# EAGLE schematic TankWaterLevelSensorV2.3 (EAGLE 9.0.1)
Tank Water Level Sensor Circuit
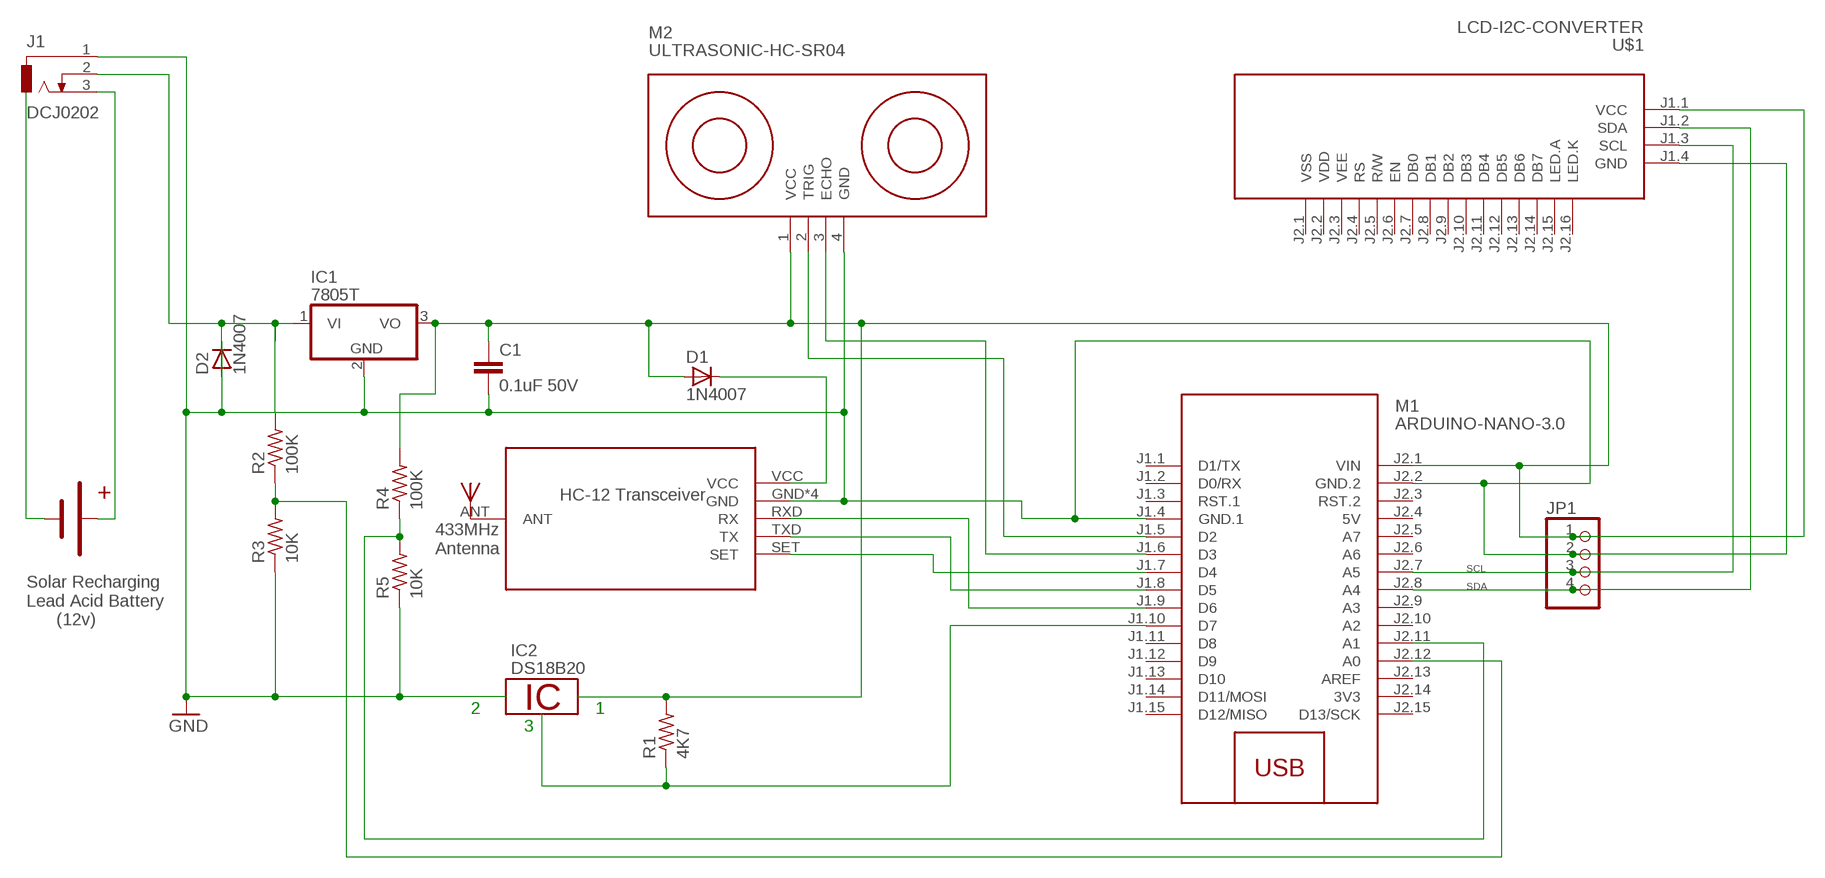
[diagram p0: schematic, sheet 1]

## Parts
433MHZ_ANT  ANTENNA  [ANTENNA]
C1  0.1uF 50V  C5/2.5  [C5B2.5]
D1  1N4007  [SMA]
D2  1N4007  [SMA]
IC1  7805T  [TO220H]
IC2  DS18B20  [TO92-]
J1  DCJ0202  [DCJ0202]
JP1  PINHD-1X4/LONG  [1X04]
M1  ARDUINO-NANO-3.0  [ARDUINO-NANO-3.0]
M2  ULTRASONIC-HC-SR04  [ULTRASONIC-HC-SR04]
M3  HC-12_FOOTPRINT  [HC-12_FOOTPRINT]
R1  4K7  R-US_0204/2V  [0204V]
R2  100K  R-US_0204/2V  [0204V]
R3  10K  R-US_0204/2V  [0204V]
R4  100K  R-US_0204/2V  [0204V]
R5  10K  R-US_0204/2V  [0204V]
SOLAR_BATTERY_12V  12v  BATTERYPAD  [BATTERYPAD]
U$1  LCD-I2C-CONVERTER  [LCD-I2C-CONVERTER]

## Nets
N$1: M1.J1.7(D4) M3.SET
N$2: M1.J1.8(D5) M3.TXD(TX)
N$3: M1.J1.9(D6) M3.RXD(RX)
N$4: M1.J1.6(D3) M2.3(ECHO)
N$5: M1.J1.5(D2) M2.2(TRIG)
N$6: C1.2 D2.A D2.K(C) IC1.1(VI) IC1.2(GND) J1.1 J1.2 JP1.2 M1.J1.4(GND.1) M1.J2.2(GND.2) M2.4(GND) M3.GND M3.GND1(GND) M3.GND2(GND) M3.MCHFIX(GND) R2.2 R3.1 R5.1 U$1.J1.4(GND)
N$7: M1.J2.12(A0) R2.1 R3.2
N$8: J1.3 SOLAR_BATTERY_12V.+VE
N$9: JP1.4 M1.J2.8(A4) U$1.J1.2(SDA)
N$10: SOLAR_BATTERY_12V.-VE
N$11: 433MHZ_ANT.ANT M3.ANT
N$12: D1.K(C) M3.VCC
N$13: JP1.3 M1.J2.7(A5) U$1.J1.3(SCL)
N$14: M1.J1.10(D7) R1.1
N$16: M1.J2.11(A1) R4.1 R5.2
N$17: C1.1 D1.A IC1.3(VO) JP1.1 M1.J2.1(VIN) M2.1(VCC) R1.2 R4.2 U$1.J1.1(VCC)
Unconnected: M1.J1.1(D1/TX) M1.J1.2(D0/RX) M1.J1.3(RST.1) M1.J1.11(D8) M1.J1.12(D9) M1.J1.13(D10) M1.J1.14(D11/MOSI) M1.J1.15(D12/MISO) M1.J2.3(RST.2) M1.J2.5(A7) M1.J2.6(A6) M1.J2.9(A3) M1.J2.10(A2) M1.J2.13(AREF) M1.J2.15(D13/SCK) U$1.J2.1(VSS) U$1.J2.2(VDD) U$1.J2.3(VEE) U$1.J2.4(RS) U$1.J2.5(R/W) U$1.J2.6(EN) U$1.J2.7(DB0) U$1.J2.8(DB1) U$1.J2.9(DB2) U$1.J2.10(DB3) U$1.J2.11(DB4) U$1.J2.12(DB5) U$1.J2.13(DB6) U$1.J2.14(DB7) U$1.J2.15(LED.A) U$1.J2.16(LED.K)

## Notes on the sheet
- HC-12 Transceiver
- 433MHz
  Antenna
- SCL
- SDA
- Solar Recharging 
  Lead Acid Battery
        (12v)
- 2 | 1
- 3

## Power pins joined to a net without a drawn wire
1W: IC2.2
3V3: M1.J2.14(3V3)
5V: M1.J2.4(5V)
GND: IC2.1
VDD: IC2.3

## Library data of the parts
433MHZ_ANT = computronics.com.au:ANTENNA: Antenna - single wire
C1 = capacitor-wima:C: CAPACITOR naming: grid - package width
D1 D2 = casovac:1N4007
IC1 = linear:78*: Positive VOLTAGE REGULATOR Source: http://cache.national.com/ds/LM/LM78L05.pdf http://www.fairchildsemi.com/ds/LM/LM7805.pdf; SPICEPREFIX: J
IC2 = 1wire:DS18B20: Programmable Resolution Digital Thermometer This chip provides a onewire thermosensor with approx. 0.5°C accuracy. A programmable over/undertemperure alarm is available. The precision can be set from 9..12 bits. Notes: Vdd must be applied for accurate measurements at low temperatures, as the parasite power circuit otherwise heats the sensor. If parasite power is used, Vdd has to be connected to GND. The DS1822 is a low-cost thermometer chip, the DS18S20 is similar to the DS18B20, but with 9 Bit precision only. Author: Jan Kandziora <jjj@gmx.de>
J1 = con-jack:DCJ0202: DC POWER JACK Source: DCJ0202.pdf; OC_FARNELL: unknown; OC_NEWARK: unknown
JP1 = pinhead_v2:PINHD-1X4: PIN HEADER
M1 = diy-modules:ARDUINO-NANO-3.0: Arduino Nano 3.0 and compatible devices More details available here: https://www.arduino.cc/en/Main/ArduinoBoardNano Click here to find device on ebay.com <http://www.ebay.com/sch/arduino+nano>
M2 = diy-modules:ULTRASONIC-HC-SR04: Ultrasonic Ranging Module HC-SR04 More details available here: http://randomnerdtutorials.com/complete-guide-for-ultrasonic-sensor-hc-sr04/ Click here to find device on ebay.com <http://www.ebay.com/sch/hc+sr04+ultrasonic>
M3 = hc12_433mhz:HC-12_FOOTPRINT: HC-12 433MHz module footprint MCHFIX is for mechanical fix pin which is NC but on this file connected to GND https://github.com/meendiz/hc-12_si4463/
R1-R5 = resistor:R-US_: RESISTOR, American symbol
SOLAR_BATTERY_12V = computronics.com.au:BATTERYPAD: Battery Pads to add external battery
U$1 = diy-modules:LCD-I2C-CONVERTER: I2C Bus to 4-Bit Parallel LCD Interface with LED backlight driver